# EAGLE design ICSP board (EAGLE 7.1.0)
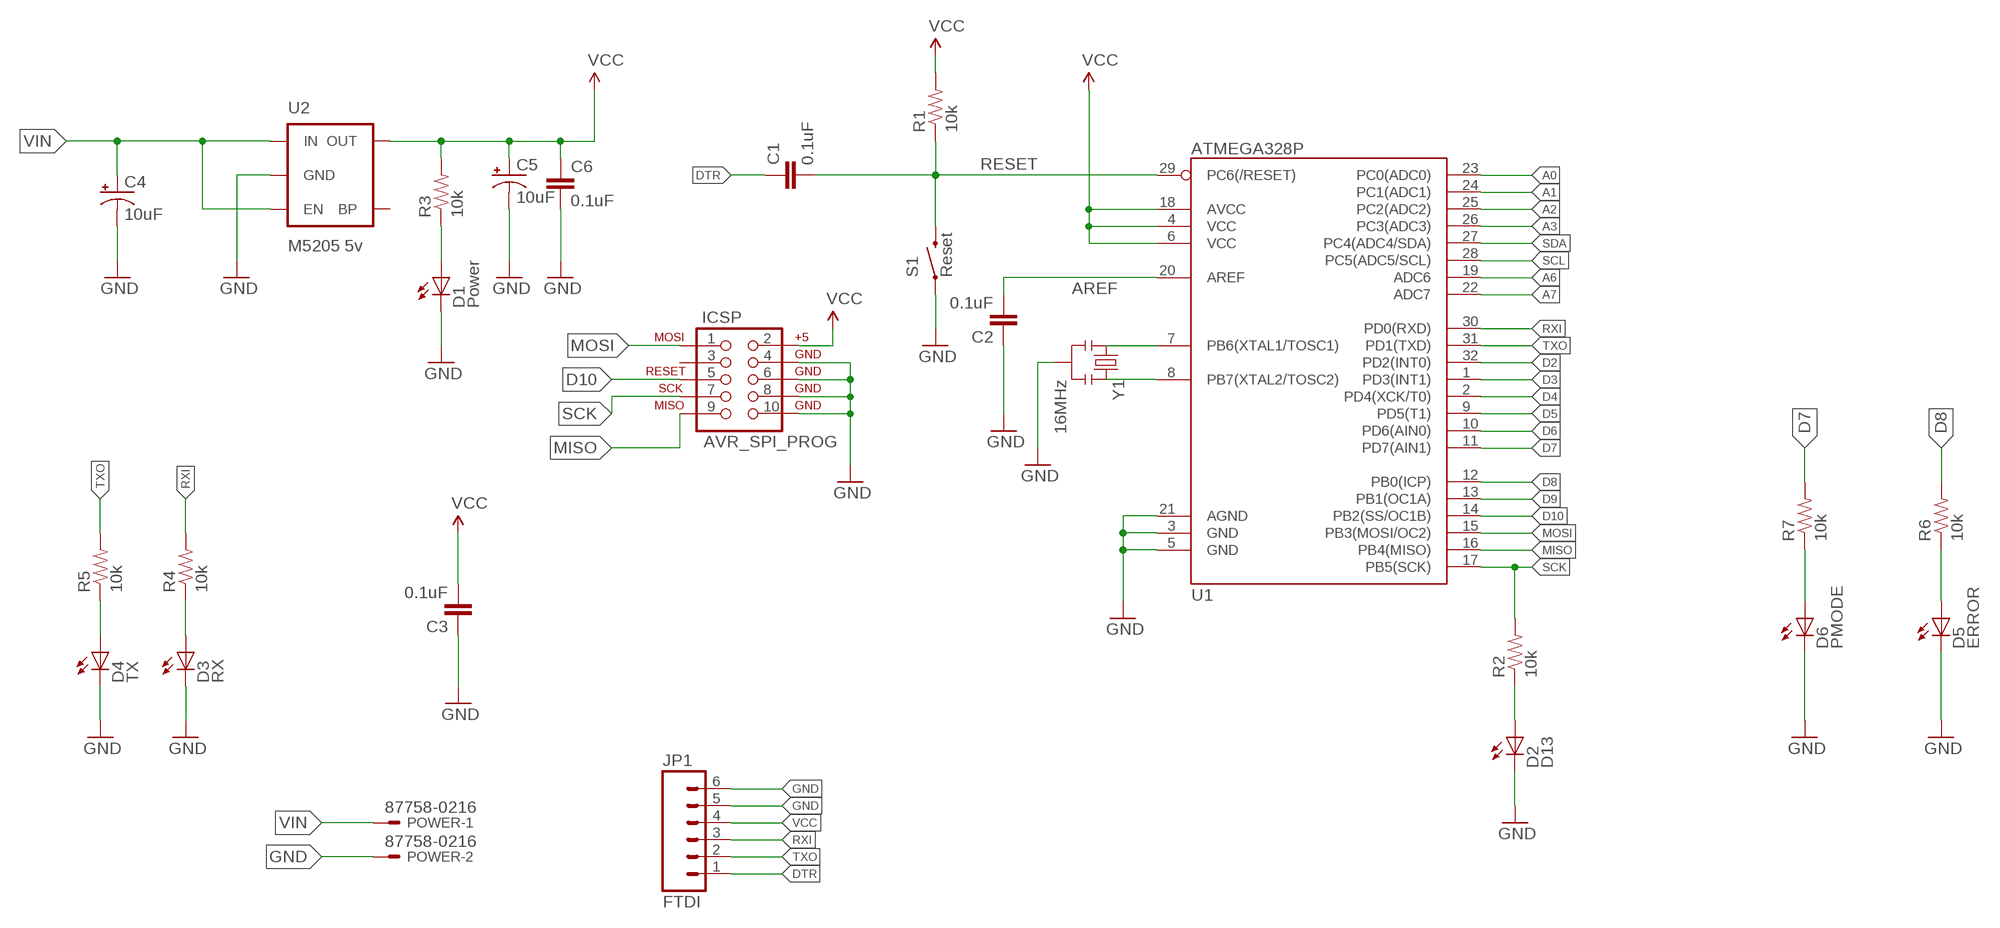
[diagram p0: schematic, sheet 1]

## Parts
C1  0.1uF  CAP0603-CAP  [0603-CAP]
C2  0.1uF  CAP0603-CAP  [0603-CAP]
C3  0.1uF  CAP0603-CAP  [0603-CAP]
C4  10uF  CAP_POL1206  [EIA3216]
C5  10uF  CAP_POL1206  [EIA3216]
C6  0.1uF  CAP0603-CAP  [0603-CAP]
D1  Power  LED-RED0603  [LED-0603]
D2  D13  LED-RED0603  [LED-0603]
D3  RX  LED-GREEN0603  [LED-0603]
D4  TX  LED-RED0603  [LED-0603]
D5  ERROR  LED-GREEN0603  [LED-0603]
D6  PMODE  LED-GREEN0603  [LED-0603]
ICSP  AVR_SPI_PROG  [AVR_ICSP]
JP1  FTDI  M06SIP  [1X06]
POWER  87758-0216  [87758-0216]
R1  10k  RESISTOR0603-RES  [0603-RES]
R2  10k  RESISTOR0603-RES  [0603-RES]
R3  10k  RESISTOR0603-RES  [0603-RES]
R4  10k  RESISTOR0603-RES  [0603-RES]
R5  10k  RESISTOR0603-RES  [0603-RES]
R6  10k  RESISTOR0603-RES  [0603-RES]
R7  10k  RESISTOR0603-RES  [0603-RES]
S1  Reset  SWITCH-MOMENTARY-2SMD  [TACTILE_SWITCH_SMD]
U1  ATMEGA328P  ATMEGA328_SMT  [TQFP32-08]
U2  M5205 5v  MIC52055V  [SOT23-5]
Y1  16MHz  RESONATOR16MHZ  [RESONATOR-SMD]

## Nets
A0: U1.23(PC0(ADC0))
A1: U1.24(PC1(ADC1))
A2: U1.25(PC2(ADC2))
A3: U1.26(PC3(ADC3))
A6: U1.19(ADC6)
A7: U1.22(ADC7)
AREF: C2.2 U1.20(AREF)
D2: U1.32(PD2(INT0))
D3: U1.1(PD3(INT1))
D4: U1.2(PD4(XCK/T0))
D5: U1.9(PD5(T1))
D6: U1.10(PD6(AIN0))
D7: R7.2 U1.11(PD7(AIN1))
D8: R6.2 U1.12(PB0(ICP))
D9: U1.13(PB1(OC1A))
D10: ICSP.5 U1.14(PB2(SS/OC1B))
DTR: C1.1 JP1.1
GND: C2.1 C3.1 C4.C(-) C5.C(-) C6.2 D1.C D2.C D3.C D4.C D5.C D6.C ICSP.4 ICSP.6 ICSP.8 ICSP.10 JP1.5 JP1.6 POWER.2 S1.1 U1.3(GND) U1.5(GND) U1.21(AGND) U2.2(GND) Y1.2
MISO: ICSP.9 U1.16(PB4(MISO))
MOSI: ICSP.1 U1.15(PB3(MOSI/OC2))
N$1: U1.7(PB6(XTAL1/TOSC1)) Y1.1
N$2: U1.8(PB7(XTAL2/TOSC2)) Y1.3
N$3: D1.A R3.1
N$4: D2.A R2.1
N$5: D3.A R4.1
N$6: D4.A R5.1
N$7: D5.A R6.1
N$8: D6.A R7.1
RESET: C1.2 R1.1 S1.3 U1.29(PC6(/RESET))
RXI: JP1.3 R4.2 U1.30(PD0(RXD))
SCK: ICSP.7 R2.2 U1.17(PB5(SCK))
SCL: U1.28(PC5(ADC5/SCL))
SDA: U1.27(PC4(ADC4/SDA))
TXO: JP1.2 R5.2 U1.31(PD1(TXD))
VCC: C3.2 C5.A(+) C6.1 ICSP.2 JP1.4 R1.2 R3.2 U1.4(VCC) U1.6(VCC) U1.18(AVCC) U2.5(OUT)
VIN: C4.A(+) POWER.1 U2.1(IN) U2.3(EN)
Unconnected: ICSP.3 U2.4(BP)

## Library data of the parts
C1-C3 C6 = SparkFun-Passives:CAP: Capacitor Standard 0603 ceramic capacitor, and 0.1" leaded capacitor.
C4 C5 = SparkFun-Passives:CAP_POL: Capacitor Polarized These are standard SMD and PTH capacitors. Normally 10uF, 47uF, and 100uF in electrolytic and tantalum varieties. Always verify the external diameter of the through hole cap, it varies with capacity, voltage, and manufacturer. The EIA devices should be standard.
D1 D2 D4 = SparkFun-LED:LED-RED: Assorted Red LEDs LilyPad 1206- DIO-09912 1206- DIO-00809 0603- DIO-00819; PROD_ID: DIO-00819; VALUE: RED
D3 D5 D6 = SparkFun-LED:LED-GREEN: Various green LEDs Green LEDs used in SFE Production 0603- DIO-00821 LARGE- DIO-00862 LILYPAD- DIO-09910; PROD_ID: DIO-00821; VALUE: GREEN
ICSP = SparkFun-Connectors:AVR_SPI_PROG: AVR 10-pin ICSP Header This is the standard AVR In Circuit Serial Programming header. Minimal, but includes pin one indicator. Works with standard Olimex programmers. Also look for the 6-pin reduced version. Spark Fun Electronics SKU: PRT-00778
JP1 = SparkFun-Connectors:M06: Header 6 Standard 6-pin 0.1" header. Use with straight break away headers (SKU : PRT-00116), right angle break away headers (PRT-00553), swiss pins (PRT-00743), machine pins (PRT-00117), and female headers (PRT-00115). Molex polarized connector foot print use with SKU : PRT-08094 with associated crimp pins and housings. NOTES ON THE VARIANTS LOCK and LOCK_LONGPADS... This footprint was designed to help hold the alignment of a through-hole component (i.e. 6-pin header) while soldering it into place. You may notice that each hole has been shifted either up or down by 0.005 of an inch from it's more standard position (which is a perfectly straight line). This slight alteration caused the pins (the squares in the middle) to touch the edges of the holes. Because they are alternating, it causes a "brace" to hold the component in place. 0.005 has proven to be the perfect amount of "off-center" position when using our standard breakaway headers. Although looks a little odd when you look at the bare footprint, once you have a header in there, the alteration is very hard to notice. Also,if you push a header all the way into place, it is covered up entirely on the bottom side. This idea of altering the position of holes to aid alignment will be further integrated into the Sparkfun Library for other footprints. It can help hold any component with 3 or more connection pins.
POWER = con-molex:87758-0216: 2 Pin - 2mm Dual Row Single Wafer, Vertical T/H HDR Source: http://www.molex.com/pdm_docs/sd/877580616_sd.pdf; MPN: 87758-0216; OC_FARNELL: unknown; OC_NEWARK: 94M1513
R1-R7 = SparkFun-Passives:RESISTOR: Resistor Basic schematic elements and footprints for 0603, 1206, and PTH resistors.
S1 = SparkFun-Electromechanical:SWITCH-MOMENTARY-2: Various NO switches- pushbuttons, reed, etc; PROD_ID: SWCH-08247
U1 = SparkFun-DigitalIC:ATMEGA328_SMT: 32-Pin Atmega328 part Commonly used on Arduino compatible boards Available in QFP and QFN packages TQFP is IC-09069 QFN is non-stock; PROD_ID: IC-09069
U2 = SparkFun-PowerIC:MIC5205: MIC5205 150mA vreg 3.3V - VREG-00822 5V - VREG-00823; PROD_ID: VREG-00823
Y1 = SparkFun-FreqCtrl:RESONATOR: Resonator Small SMD resonator. Used, eg, on the Arduino Pro/ Pro Mini boards. 8MHz- XTAL-08895 16MHz- XTAL-08900; PROD_ID: XTAL-08900

## Board
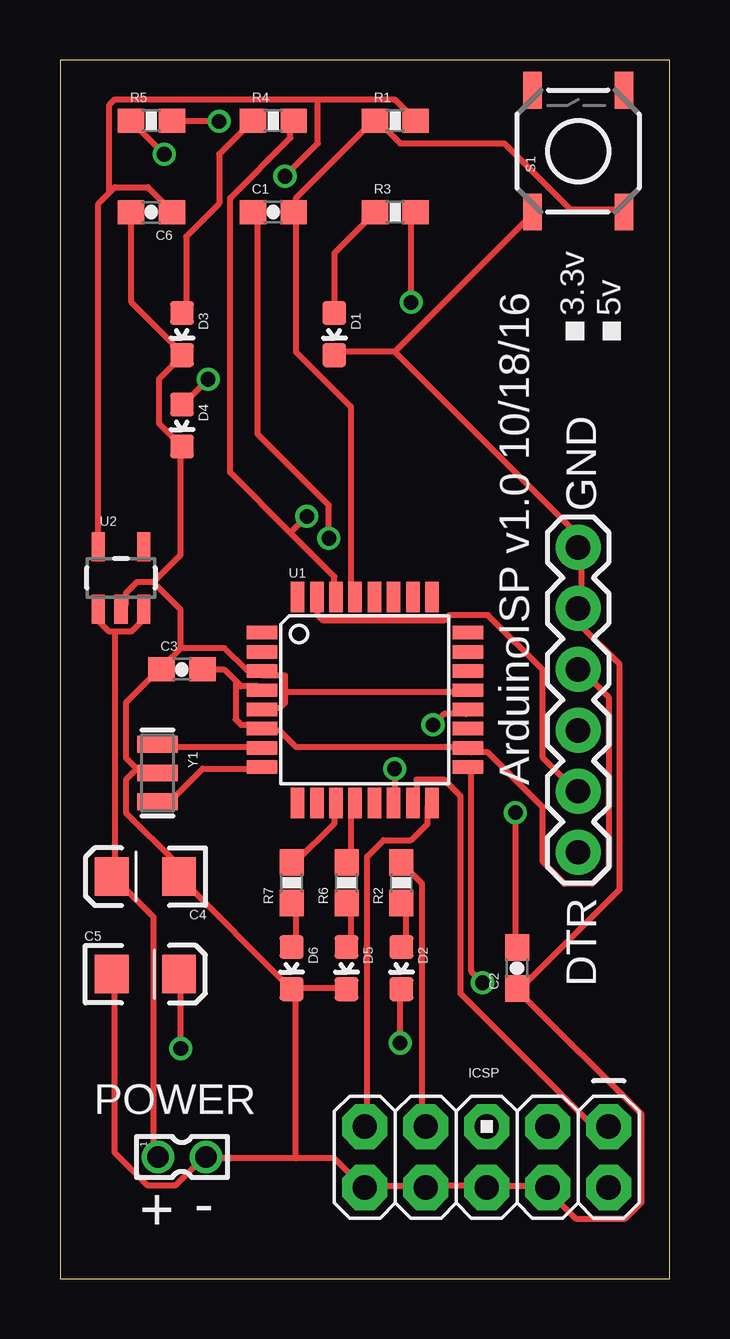
[diagram p1: board, top side]
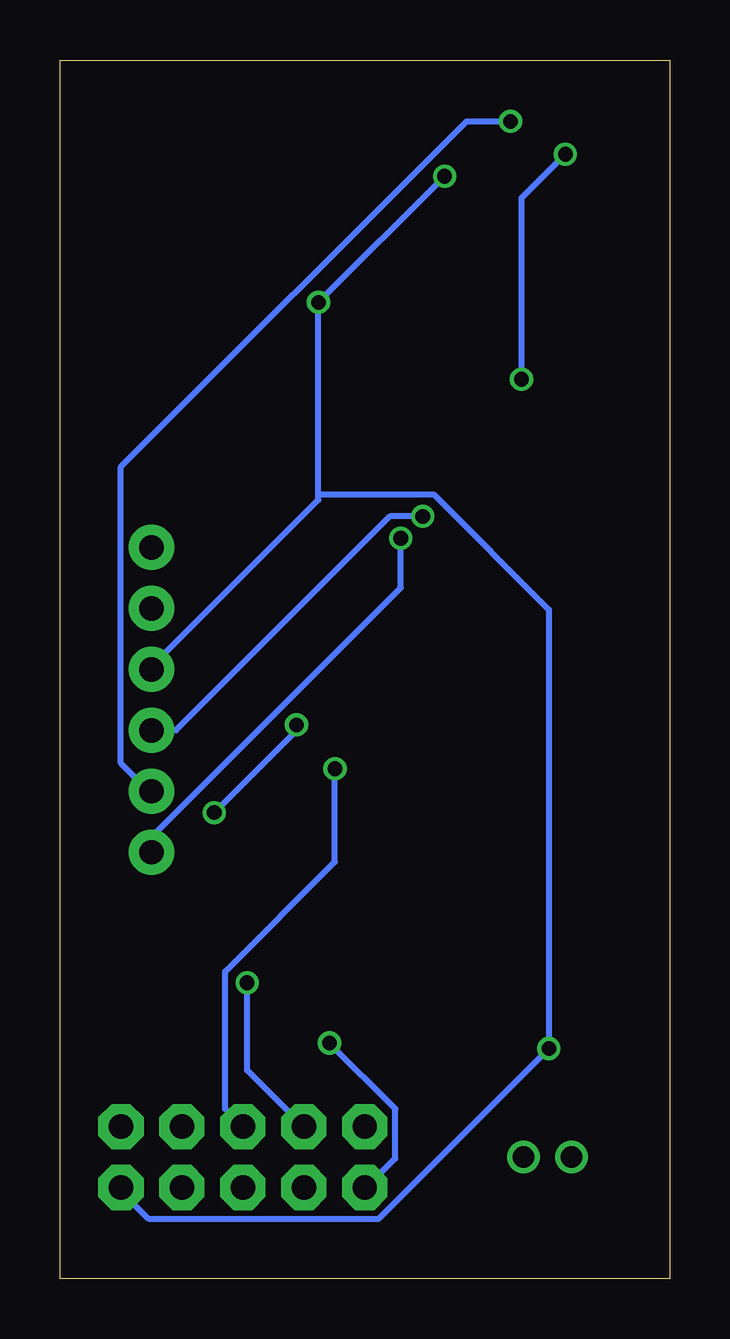
[diagram p2: board, bottom side, seen from below]

Size 25.4 x 50.79 mm. Coordinates in mm from the lower left corner, seen from the top.
Outline: 0,0 25.4,0 25.4,50.79 0,50.79 0,0
Copper layers (1*16): Top 0.0356mm / dielectric 1.5011mm / Bottom 0.0356mm
Design rules "LaenPCBOrder": minimum track width 6mil, minimum drill 13mil, track to track 6mil, track to pad 6mil, pad to pad 6mil, via to via 6mil, smd to smd 6mil, copper to edge 15mil, drill to drill 6mil, minimum pad ring 7mil, minimum via ring 7mil, stop-mask expansion 3mil, vias tented up to drill 0mil, thermal gap 10mil

### Footprints (pad centres in the part's own frame; a part is rotated, then mirrored left to right if it is on the bottom)
0603-CAP = smd 1.1 x 1: 1 -0.85,0; 2 0.85,0
EIA3216 = smd 1.4 x 1.6: A 1.4,0; C -1.4,0
LED-0603 = smd 1 x 1: A 0,-0.877; C 0,0.877
AVR_ICSP = drill 1.016 pad 1.88 octagon: 1 -1.27,5.08; 2 1.27,5.08; 3 -1.27,2.54; 4 1.27,2.54; 5 -1.27,0; 6 1.27,0; 7 -1.27,-2.54; 8 1.27,-2.54; 9 -1.27,-5.08; 10 1.27,-5.08
1X06 = drill 1.016 pad 1.88: 1 0,0; 2 2.54,0; 3 5.08,0; 4 7.62,0; 5 10.16,0; 6 12.7,0
87758-0216 = drill 0.9 pad 1.27: 1 0,-1; 2 0,1
0603-RES = smd 1.1 x 1: 1 -0.85,0; 2 0.85,0
TACTILE_SWITCH_SMD = smd 1.524 x 0.762: 1 -2.54,1.905; 2 2.54,1.905; 3 -2.54,-1.905; 4 2.54,-1.905
TQFP32-08 = smd 1.27 x 0.559: 1 -4.293,2.8; 2 -4.293,2; 3 -4.293,1.2; 4 -4.293,0.4; 5 -4.293,-0.4; 6 -4.293,-1.2; 7 -4.293,-2; 8 -4.293,-2.8; 17 4.293,-2.8; 18 4.293,-2; 19 4.293,-1.2; 20 4.293,-0.4; 21 4.293,0.4; 22 4.293,1.2; 23 4.293,2; 24 4.293,2.8 | smd 0.559 x 1.27: 9 -2.8,-4.293; 10 -2,-4.293; 11 -1.2,-4.293; 12 -0.4,-4.293; 13 0.4,-4.293; 14 1.2,-4.293; 15 2,-4.293; 16 2.8,-4.293; 25 2.8,4.293; 26 2,4.293; 27 1.2,4.293; 28 0.4,4.293; 29 -0.4,4.293; 30 -1.2,4.293; 31 -2,4.293; 32 -2.8,4.293
SOT23-5 = smd 0.55 x 1.2: 1 -0.95,-1.3; 2 0,-1.3; 3 0.95,-1.3; 4 0.95,1.3; 5 -0.95,1.3
RESONATOR-SMD = smd 0.7 x 1.7: 1 -1.2,0; 2 0,0; 3 1.2,0

### Placement (x,y rotation side)
C1  8.89,44.45 0 top
C2  19.05,12.95 90 top
C3  5.08,25.4 0 top
C4  3.56,16.76 180 top
C5  3.56,12.7 0 top
C6  3.81,44.45 180 top
D1  11.43,39.37 180 top
D2  14.22,12.95 180 top
D3  5.08,39.37 180 top
D4  5.08,35.56 180 top
D5  11.94,12.95 180 top
D6  9.65,12.95 180 top
ICSP  17.78,5.08 270 top
JP1  21.59,17.78 90 top
POWER  5.08,5.08 270 top
R1  13.97,48.26 0 top
R2  14.22,16.51 90 top
R3  13.97,44.45 0 top
R4  8.89,48.26 0 top
R5  3.81,48.26 0 top
R6  11.94,16.51 90 top
R7  9.65,16.51 90 top
S1  21.59,46.99 90 top
U1  12.7,24.13 0 top
U2  2.54,29.21 0 top
Y1  4.06,21.08 270 top

### Tracks (layer width: path | path; a pad name or v marks a point on that pad's centre or on a via)
AREF  (via drill 0.61)
  Top 0.254: v18.97,19.43 18.97,13.95 C2.2 | v15.54,23.09 16,23.55 16.92,23.55 U1.20
  Bottom 0.254: v18.97,19.43 15.54,22.86 v15.54,23.09
D7
  Top 0.254: R7.2 9.83,17.37 11.43,18.97 11.43,19.66 U1.11
D8
  Top 0.254: R6.2 12.12,17.37 12.12,19.66 U1.12
D10  (via drill 0.61)
  Top 0.254: v13.95,21.26 13.95,19.89 U1.14
  Bottom 0.254: v13.95,21.26 13.95,17.37 18.52,12.8 18.52,7.09 ICSP.5
DTR  (via drill 0.61)
  Top 0.254: v11.2,30.86 11.2,32.23 8.23,35.2 8.23,44.35 C1.1
  Bottom 0.254: v11.2,30.86 11.2,28.8 21.49,18.52 21.49,17.83 JP1.1
GND  (via drill 0.61)
  Top 0.254: D6.C 9.83,12.12 11.89,12.12 D5.C | D6.C 9.6,12.12 5.03,16.69 C4.C 4.8,16.92 4.8,17.37 2.74,19.43 2.74,20.8 3.2,21.26 | C6.2 2.97,44.35 2.97,40.69 5.03,38.63 D3.C 5.03,38.41 4.12,37.49 4.12,35.66 5.03,34.75 D4.C 5.03,34.52 5.03,30.18 3.89,29.03 | 5.03,26.29 4.34,25.6 C3.1 4.12,25.38 2.74,24 2.74,21.72 3.2,21.26 | 5.03,26.29 6.86,26.29 7.77,25.38 8.23,25.38 U1.3 8.46,25.15 9.37,25.15 9.37,24.46 | 3.89,29.03 3.2,29.03 2.74,28.57 2.74,28.12 U2.2 | 3.89,29.03 5.03,27.89 5.03,26.29 | 9.37,24.46 9.37,24 9.14,23.77 8.46,23.77 U1.5 | 9.37,24.46 16.92,24.46 U1.21 | 3.2,21.26 3.89,21.26 Y1.2 | 13.95,38.63 11.43,38.63 D1.C | 13.95,38.63 19.66,44.35 S1.1 | 13.95,38.63 21.49,31.09 21.49,30.63 JP1.6 21.72,30.4 21.72,28.12 JP1.5 21.72,27.89 21.72,27.2 23.32,25.6 23.32,16.23 19.2,12.12 C2.1 19.2,11.89 24.23,6.86 24.23,3.2 23.55,2.52 21.49,2.52 20.34,3.66 ICSP.4 20.12,3.89 17.83,3.89 ICSP.6 17.6,3.89 15.32,3.89 ICSP.8 15.09,3.89 12.8,3.89 ICSP.10 12.57,3.89 11.43,5.03 9.83,5.03 | C5.C 2.29,12.57 2.29,5.26 3.66,3.89 4.8,3.89 5.94,5.03 POWER.2 6.17,5.03 9.83,5.03 | v14.17,9.83 14.17,11.89 D2.C | 9.83,5.03 9.83,11.89 D6.C
  Bottom 0.254: v14.17,9.83 11.43,7.09 11.43,5.03 12.57,3.89 ICSP.10
MISO
  Top 0.254: U1.16 15.32,19.66 15.32,18.97 14.63,18.29 13.49,18.29 12.8,17.6 12.8,6.4 ICSP.9
MOSI
  Top 0.254: U1.15 14.86,19.89 14.86,20.8 16,20.8 16.69,20.12 16.69,11.89 22.17,6.4 22.86,6.4 ICSP.1
N$1
  Top 0.254: U1.7 8.23,22.17 4.12,22.17 Y1.1
N$2
  Top 0.254: U1.8 8.23,21.26 5.94,21.26 4.57,19.89 4.12,19.89 Y1.3
N$3
  Top 0.254: D1.A 11.43,42.75 13.03,44.35 R3.1
N$4
  Top 0.254: D2.A 14.4,13.95 14.4,15.54 R2.1
N$5
  Top 0.254: D3.A 5.26,40.46 5.26,43.43 6.63,44.81 6.63,46.86 8,48.23 R4.1
N$6  (via drill 0.61)
  Top 0.254: v6.17,37.49 5.26,36.58 D4.A | v4.34,46.86 2.97,48.23 R5.1
  Bottom 0.254: v6.17,37.49 6.17,45.03 v4.34,46.86
N$7
  Top 0.254: D5.A 12.12,13.95 12.12,15.54 R6.1
N$8
  Top 0.254: D6.A 9.83,13.95 9.83,15.54 R7.1
RESET
  Top 0.254: U1.29 12.12,28.57 12.12,36.35 9.83,38.63 9.83,44.35 C1.2 9.83,44.58 9.83,45.03 13.03,48.23 R1.1 13.26,48.23 14.17,47.32 18.52,47.32 21.26,44.58 23.32,44.58 S1.3
RXI  (via drill 0.61)
  Top 0.254: 9.6,31.09 11.43,29.26 11.43,28.57 U1.30 | 9.6,31.09 7.09,33.6 7.09,45.03 9.6,47.55 9.6,48.23 R4.2 | 9.6,31.09 v10.29,31.77
  Bottom 0.254: JP1.3 20.57,22.86 11.66,31.77 v10.29,31.77
SCK  (via drill 0.61)
  Top 0.254: R2.2 14.4,17.14 15.09,16.46 15.09,6.4 ICSP.7 | v17.6,12.34 17.14,12.8 17.14,21.26 U1.17
  Bottom 0.254: v17.6,12.34 17.6,8.69 15.32,6.4 ICSP.7
TXO  (via drill 0.61)
  Top 0.254: v6.63,48.23 4.8,48.23 R5.2 | U1.31 10.74,28.35 10.74,27.66 10.97,27.43 16,27.43 16.23,27.66 17.83,27.66 20.12,25.38 20.12,21.72 21.49,20.34 JP1.2
  Bottom 0.254: v6.63,48.23 8.46,48.23 22.86,33.83 22.86,21.49 21.72,20.34 JP1.2
VCC  (via drill 0.61)
  Top 0.254: v5.03,9.6 5.03,12.57 C5.A | 2.06,45.26 1.6,44.81 1.6,30.63 U2.5 | 2.06,45.26 2.29,45.49 3.66,45.49 4.57,44.58 C6.1 | 10.74,49.15 2.29,49.15 2.06,48.92 2.06,45.26 | 10.74,49.15 13.95,49.15 14.63,48.46 R1.2 | 7.32,24.92 7.54,24.69 8.23,24.69 U1.4 | 7.32,24.92 6.86,25.38 5.94,25.38 C3.2 | 7.32,24.92 7.32,23.32 7.54,23.09 8.23,23.09 U1.6 8.46,22.86 9.14,22.86 9.83,22.17 16.92,22.17 U1.18 17.14,21.95 17.83,21.95 20.12,19.66 20.12,17.37 21.03,16.46 22.17,16.46 22.86,17.14 22.86,24.23 21.72,25.38 JP1.4 | v14.63,40.69 14.63,44.35 R3.2 | 10.74,49.15 10.74,47.32 v9.37,45.95
  Bottom 0.254: ICSP.2 22.86,3.66 21.72,2.52 12.12,2.52 v5.03,9.6 5.03,27.89 9.83,32.69 14.63,32.69 | 14.63,32.69 14.63,32.46 21.49,25.6 JP1.4 | 14.63,32.69 v14.63,40.69 v9.37,45.95
VIN
  Top 0.254: 2.29,26.98 2.97,26.98 3.43,27.43 3.43,27.89 U2.3 | 2.29,26.98 2.06,26.98 1.6,27.43 1.6,27.89 U2.1 | 2.29,26.98 2.29,16.92 C4.A 2.29,16.69 3.89,15.09 3.89,5.26 POWER.1

### Text on the board
tPlace: 3.3v / 5v | GND | ArduinoISP v1.0 10/18/16 | DTR | + | -